# EAGLE schematic PANS (EAGLE 7.6.0)
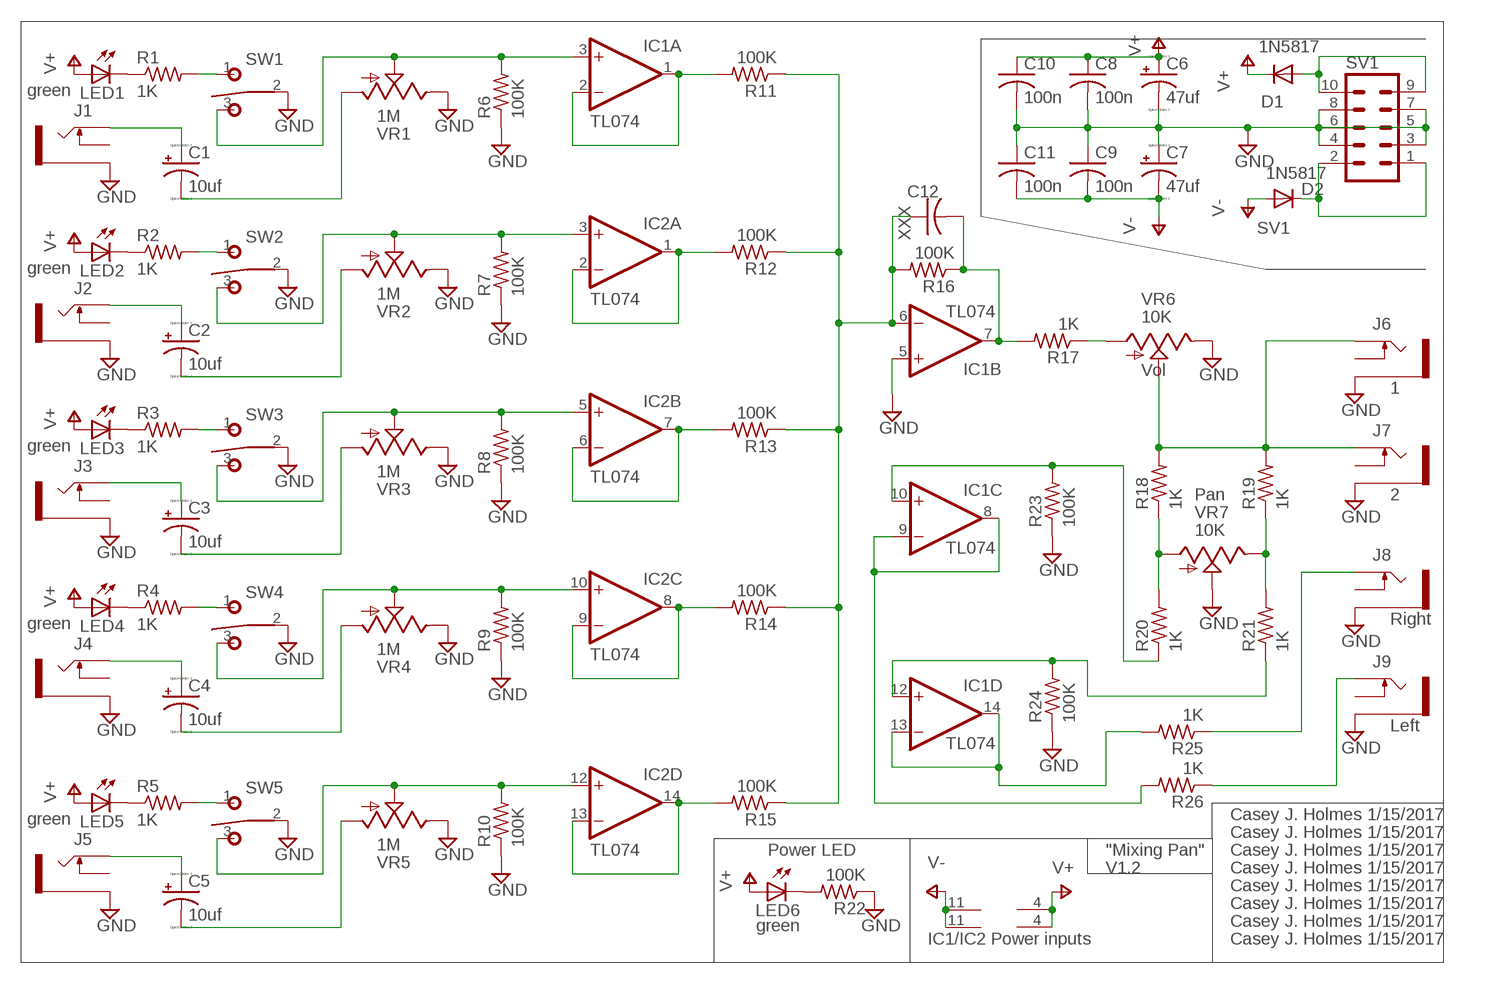
[diagram p0: schematic, sheet 1]

## Parts
C1  10uf  CPOL-US153CLV-0405  [153CLV-0405]
C2  10uf  CPOL-US153CLV-0405  [153CLV-0405]
C3  10uf  CPOL-US153CLV-0405  [153CLV-0405]
C4  10uf  CPOL-US153CLV-0405  [153CLV-0405]
C5  10uf  CPOL-US153CLV-0405  [153CLV-0405]
C6  47uf  CPOL-USD  [PANASONIC_D]
C7  47uf  CPOL-USD  [PANASONIC_D]
C8  100n  C-USC0805  [C0805]
C9  100n  C-USC0805  [C0805]
C10  100n  C-USC0805  [C0805]
C11  100n  C-USC0805  [C0805]
C12  XXX  C-USC0805  [C0805]
D1  1N5817  SMALL_DIODEDO35-7  [DO35-7]
D2  1N5817  SMALL_DIODEDO35-7  [DO35-7]
IC1  TL074  TL074_SMD  [SO14]
IC2  TL074  TL074_SMD  [SO14]
J1  THONKICONNOLD  [THONKICONN]
J2  THONKICONNOLD  [THONKICONN]
J3  THONKICONNOLD  [THONKICONN]
J4  THONKICONNOLD  [THONKICONN]
J5  THONKICONNOLD  [THONKICONN]
J6  THONKICONNOLD  [THONKICONN]
J7  THONKICONNOLD  [THONKICONN]
J8  THONKICONNOLD  [THONKICONN]
J9  THONKICONNOLD  [THONKICONN]
LED1  green  LED5MM  [LED5MM]
LED2  green  LED5MM  [LED5MM]
LED3  green  LED5MM  [LED5MM]
LED4  green  LED5MM  [LED5MM]
LED5  green  LED5MM  [LED5MM]
LED6  green  LED5MM  [LED5MM]
R1  1K  R-US_M0805  [M0805]
R2  1K  R-US_M0805  [M0805]
R3  1K  R-US_M0805  [M0805]
R4  1K  R-US_M0805  [M0805]
R5  1K  R-US_M0805  [M0805]
R6  100K  R-US_M0805  [M0805]
R7  100K  R-US_M0805  [M0805]
R8  100K  R-US_M0805  [M0805]
R9  100K  R-US_M0805  [M0805]
R10  100K  R-US_M0805  [M0805]
R11  100K  R-US_M0805  [M0805]
R12  100K  R-US_M0805  [M0805]
R13  100K  R-US_M0805  [M0805]
R14  100K  R-US_M0805  [M0805]
R15  100K  R-US_M0805  [M0805]
R16  100K  R-US_M0805  [M0805]
R17  1K  R-US_M0805  [M0805]
R18  1K  R-US_M0805  [M0805]
R19  1K  R-US_M0805  [M0805]
R20  1K  R-US_M0805  [M0805]
R21  1K  R-US_M0805  [M0805]
R22  100K  R-US_M0805  [M0805]
R23  100K  R-US_M0805  [M0805]
R24  100K  R-US_M0805  [M0805]
R25  1K  R-US_M0805  [M0805]
R26  1K  R-US_M0805  [M0805]
SV1  SV1  EURO_POWER_HEADERFAT_PADS  [EURO_PWR_HEADER_FAT]
SW1  on/on  T-80-T-SPDT-ON-OFF-ON  [M9040P]
SW2  on/on  T-80-T-SPDT-ON-OFF-ON  [M9040P]
SW3  on/on  T-80-T-SPDT-ON-OFF-ON  [M9040P]
SW4  on/on  T-80-T-SPDT-ON-OFF-ON  [M9040P]
SW5  on/on  T-80-T-SPDT-ON-OFF-ON  [M9040P]
VR1  1M  9MM_SNAP-IN_POT_  [9MM_SNAP-IN_POT]
VR2  1M  9MM_SNAP-IN_POT_  [9MM_SNAP-IN_POT]
VR3  1M  9MM_SNAP-IN_POT_  [9MM_SNAP-IN_POT]
VR4  1M  9MM_SNAP-IN_POT_  [9MM_SNAP-IN_POT]
VR5  1M  9MM_SNAP-IN_POT_  [9MM_SNAP-IN_POT]
VR6  10K  9MM_SNAP-IN_POT_  [9MM_SNAP-IN_POT]
VR7  10K  9MM_SNAP-IN_POT_  [9MM_SNAP-IN_POT]

## Nets
C2: C2.+ J2.P$3_TIP(TIP)
GND: C6.- C7.+ C8.2 C9.1 C10.2 C11.1 IC1.5(B:+IN) J1.P$1_SLEEVE(SLEEVE) J2.P$1_SLEEVE(SLEEVE) J3.P$1_SLEEVE(SLEEVE) J4.P$1_SLEEVE(SLEEVE) J5.P$1_SLEEVE(SLEEVE) J6.P$1_SLEEVE(SLEEVE) J7.P$1_SLEEVE(SLEEVE) J8.P$1_SLEEVE(SLEEVE) J9.P$1_SLEEVE(SLEEVE) R6.1 R7.1 R8.1 R9.1 R10.1 R22.1 R23.1 R24.1 SV1.3 SV1.4 SV1.5 SV1.6 SV1.7 SV1.8 SW1.2(P) SW2.2(P) SW3.2(P) SW4.2(P) SW5.2(P) VR1.3(E) VR2.3(E) VR3.3(E) VR4.3(E) VR5.3(E) VR6.3(E) VR7.2(S)
IC1: IC1.1(A:OUT) IC1.2(A:-IN) R11.2
N$1: J8.P$3_TIP(TIP) R25.1
N$2: C1.+ J1.P$3_TIP(TIP)
N$3: R1.2 SW1.1(O)
N$4: LED1.K(C) R1.1
N$5: C1.- VR1.1(A)
N$6: R2.2 SW2.1(O)
N$7: LED2.K(C) R2.1
N$8: LED4.K(C) R4.1
N$9: IC1.3(A:+IN) R6.2 SW1.3(S) VR1.2(S)
N$10: LED5.K(C) R5.1
N$11: LED3.K(C) R3.1
N$12: R5.2 SW5.1(O)
N$13: C3.+ J3.P$3_TIP(TIP)
N$14: R3.2 SW3.1(O)
N$15: R4.2 SW4.1(O)
N$16: C4.+ J4.P$3_TIP(TIP)
N$17: C5.+ J5.P$3_TIP(TIP)
N$18: C2.- VR2.1(A)
N$19: C3.- VR3.1(A)
N$20: C4.- VR4.1(A)
N$21: C5.- VR5.1(A)
N$22: IC2.3(A:+IN) R7.2 SW2.3(S) VR2.2(S)
N$23: IC2.5(B:+IN) R8.2 SW3.3(S) VR3.2(S)
N$24: IC2.10(C:+IN) R9.2 SW4.3(S) VR4.2(S)
N$25: IC2.12(D:+IN) R10.2 SW5.3(S) VR5.2(S)
N$26: J9.P$3_TIP(TIP) R26.1
N$27: IC2.1(A:OUT) IC2.2(A:-IN) R12.2
N$28: IC2.6(B:-IN) IC2.7(B:OUT) R13.2
N$29: IC2.8(C:OUT) IC2.9(C:-IN) R14.2
N$30: IC2.13(D:-IN) IC2.14(D:OUT) R15.2
N$31: C12.1 IC1.6(B:-IN) R11.1 R12.1 R13.1 R14.1 R15.1 R16.2
N$32: C12.2 IC1.7(B:OUT) R16.1 R17.2
N$34: R17.1 VR6.1(A)
N$35: J6.P$3_TIP(TIP) J7.P$3_TIP(TIP) R18.2 R19.2 VR6.2(S)
N$36: R19.1 R21.2 VR7.3(E)
N$37: LED6.K(C) R22.2
N$38: R18.1 R20.2 VR7.1(A)
N$39: IC1.8(C:OUT) IC1.9(C:-IN) R26.2
N$40: IC1.13(D:-IN) IC1.14(D:OUT) R25.2
N$41: IC1.10(C:+IN) R20.1 R23.2
N$42: D2.C SV1.1 SV1.2
N$43: IC1.12(D:+IN) R21.1 R24.2
SV1: D1.A SV1.9 SV1.10
V+: C6.+ C8.1 C10.1 D1.C IC1.4(P:V+) IC2.4(P:V+) LED1.A LED2.A LED3.A LED4.A LED5.A LED6.A
V-: C7.- C9.2 C11.2 D2.A IC1.11(P:V-) IC2.11(P:V-)
Unconnected: J1.P$2_SWITCH(SWITCH) J2.P$2_SWITCH(SWITCH) J3.P$2_SWITCH(SWITCH) J4.P$2_SWITCH(SWITCH) J5.P$2_SWITCH(SWITCH) J6.P$2_SWITCH(SWITCH) J7.P$2_SWITCH(SWITCH) J8.P$2_SWITCH(SWITCH) J9.P$2_SWITCH(SWITCH)

## Notes on the sheet
- Vol
- 1
- Pan | 2
- Right
- Left
- Casey J. Holmes 1/15/2017
- Casey J. Holmes 1/15/2017
- Power LED | "Mixing Pan" | Casey J. Holmes 1/15/2017
- V1.2 | Casey J. Holmes 1/15/2017
- Casey J. Holmes 1/15/2017
- Casey J. Holmes 1/15/2017
- Casey J. Holmes 1/15/2017
- IC1/IC2 Power inputs | Casey J. Holmes 1/15/2017

## Library data of the parts
C1-C7 = resistor:CPOL-US: POLARIZED CAPACITOR, American symbol
C8-C12 = resistor:C-US: CAPACITOR, American symbol
D1 D2 = MusicThingModular:SMALL_DIODE: Small Signal Diode
IC1 IC2 = MusicThingModular:TL074: Generic Quad Op Amp
J1-J9 = MusicThingModular:THONKICONN: 3.5mm socket for Eurorack modular synths
LED1-LED6 = adafruit:LED: LED OSRAM: - CHIPLED LG R971, LG N971, LY N971, LG Q971, LY Q971, LO R971, LY R971 LH N974, LH R974 LS Q976, LO Q976, LY Q976 LO Q996 - Hyper CHIPLED LW Q18S LB Q993, LB Q99A, LB R99A - SideLED LS A670, LO A670, LY A670, LG A670, LP A670 LB A673, LV A673, LT A673, LW A673 LH A674 LY A675 LS A676, LA A676, LO A676, LY A676, LW A676 LS A679, LY A679, LG A679 - Hyper Micro SIDELED® LS Y876, LA Y876, LO Y876, LY Y876 LT Y87S - SmartLED LW L88C, LW L88S LB L89C, LB L89S, LG L890 LS L89K, LO L89K, LY L89K LS L896, LA L896, LO L896, LY L896 - TOPLED LS T670, LO T670, LY T670, LG T670, LP T670 LSG T670, LSP T670, LSY T670, LOP T670, LYG T670 LG T671, LOG T671, LSG T671 LB T673, LV T673, LT T673, LW T673 LH T674 LS T676, LA T676, LO T676, LY T676, LB T676, LH T676, LSB T676, LW T676 LB T67C, LV T67C, LT T67C, LS T67K, LO T67K, LY T67K, LW E67C LS E67B, LA E67B, LO E67B, LY E67B, LB E67C, LV E67C, LT E67C LW T67C LS T679, LY T679, LG T679 LS T770, LO T770, LY T770, LG T770, LP T770 LB T773, LV T773, LT T773, LW T773 LH T774 LS E675, LA E675, LY E675, LS T675 LS T776, LA T776, LO T776, LY T776, LB T776 LHGB T686 LT T68C, LB T68C - Hyper Mini TOPLED® LB M676 - Mini TOPLED Santana® LG M470 LS M47K, LO M47K, LY M47K Source: http://www.osram.convergy.de/
R1-R26 = resistor:R-US_: RESISTOR, American symbol
SV1 = MusicThingModular:EURO_POWER_HEADER: Power Header 10 pin power header for Eurorack Power Supplies Variants with fatter pads for easier soldering, and the LOCK variant which has 5mil offset pins to hold the component in place before soldering
SW1-SW5 = MusicThingModular:T-80-T-SPDT-ON-OFF-ON
VR1-VR7 = MusicThingModular:9MM_SNAP-IN_POT: 9mm vertical snap-in pot, Alpha / Panasonic style